# EAGLE schematic Atmega328p-Rst-Rec (EAGLE 8.0.1)
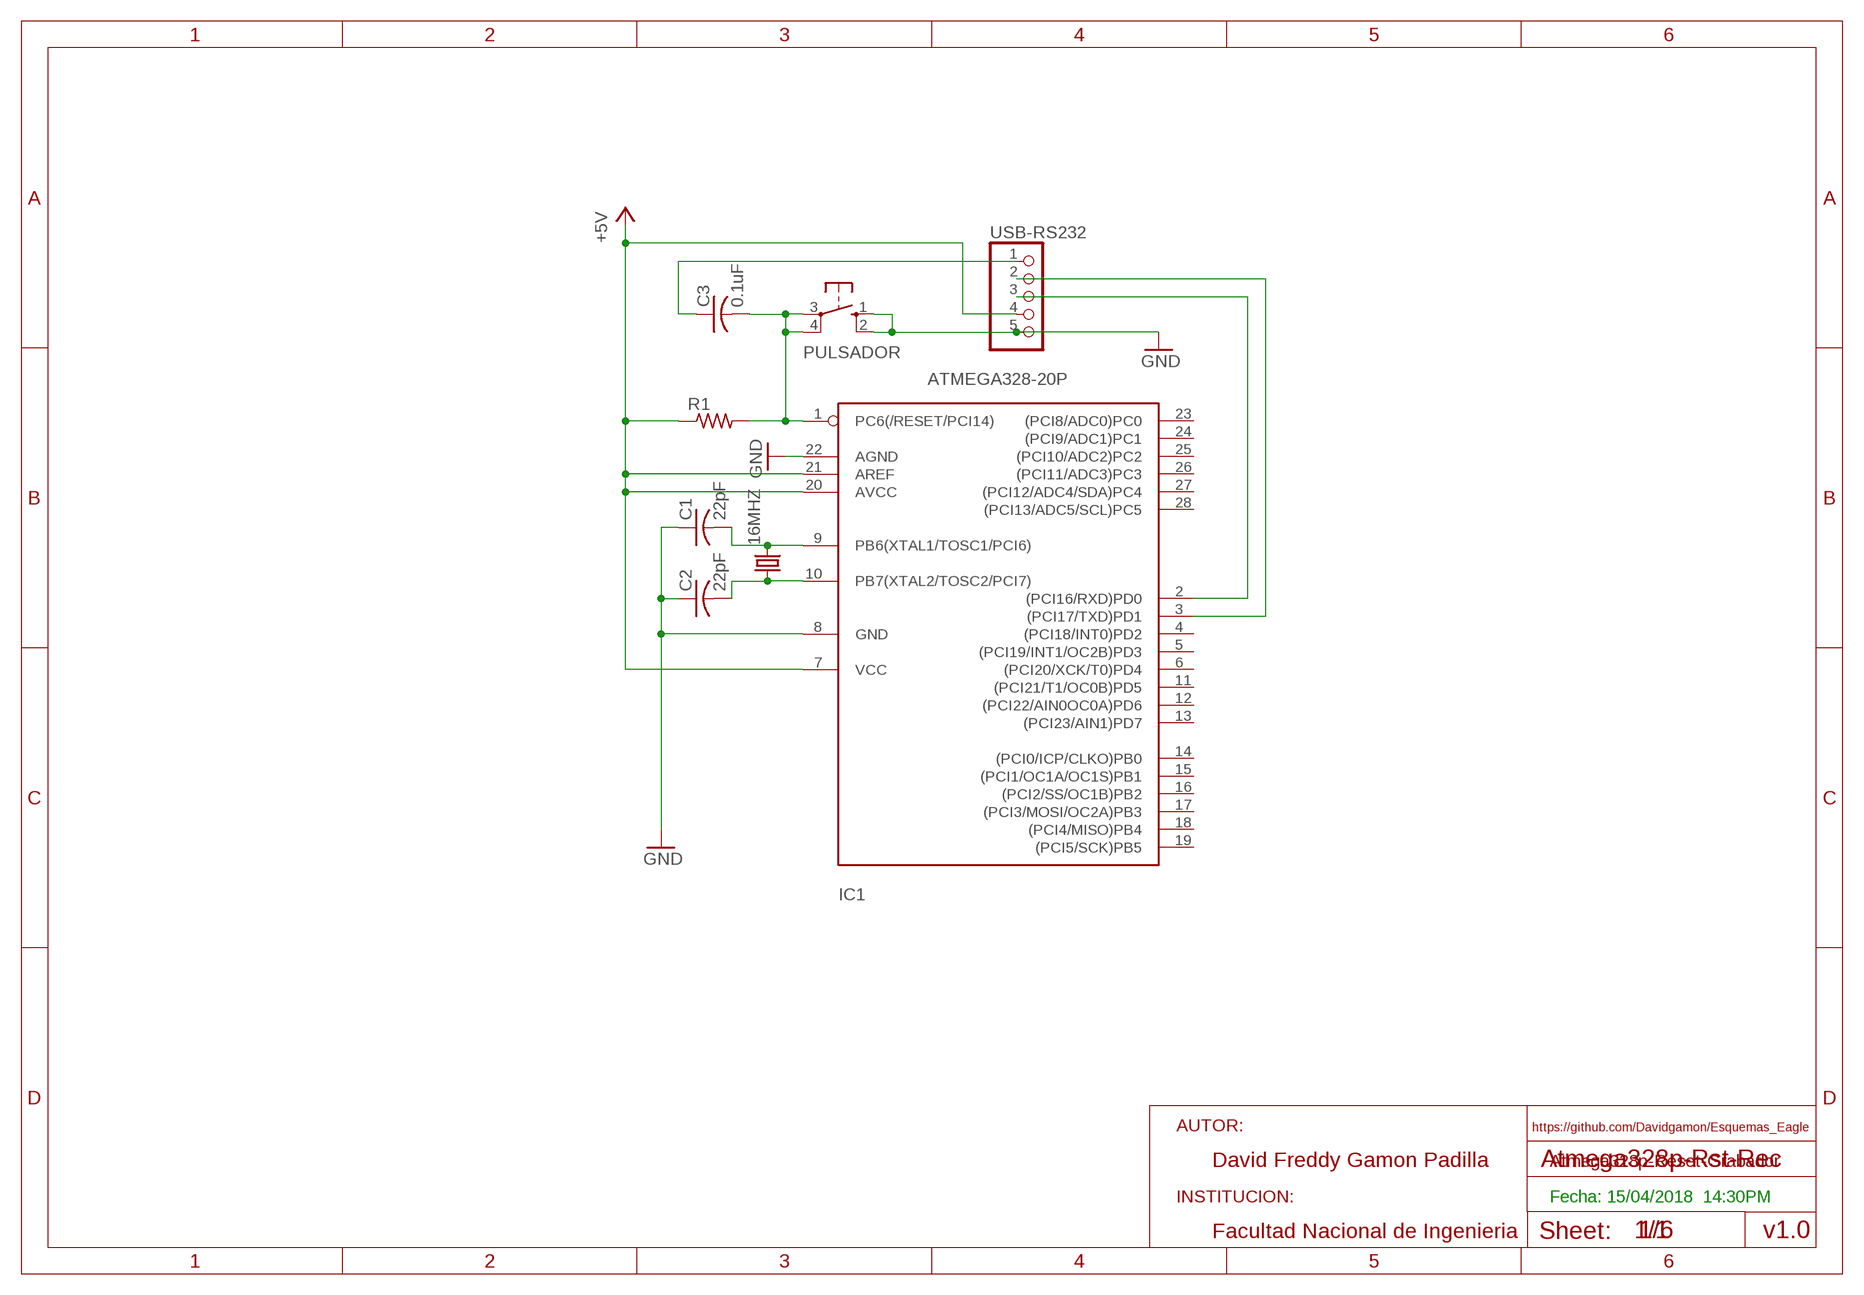
[diagram p0: schematic, sheet 1]

## Parts
16MHZ  CRYSTALHC49S  [HC49/S]
C1  22pF  C-US025-030X050  [C025-030X050]
C2  22pF  C-US025-030X050  [C025-030X050]
C3  0.1uF  C-US025-030X050  [C025-030X050]
IC1  ATMEGA328-20P  [DIL28-3]
PULSADOR  10-XX  [B3F-10XX]
R1  R-US_0309/12  [0309/12]
USB-RS232  PINHD-1X5  [1X05]

## Nets
+5V: IC1.7(VCC) IC1.20(AVCC) IC1.21(AREF) R1.1 USB-RS232.4
GND: C1.1 C2.1 IC1.8(GND) IC1.22(AGND) PULSADOR.1(S) PULSADOR.2(S1) USB-RS232.5
N$2: C3.1 USB-RS232.1
N$3: 16MHZ.2 C1.2 IC1.9(PB6(XTAL1/TOSC1/PCI6))
N$4: 16MHZ.1 C2.2 IC1.10(PB7(XTAL2/TOSC2/PCI7))
N$5: IC1.3((PCI17/TXD)PD1) USB-RS232.2
RESET: C3.2 IC1.1(PC6(/RESET/PCI14)) PULSADOR.3(P) PULSADOR.4(P1) R1.2
USB-RS232: IC1.2((PCI16/RXD)PD0) USB-RS232.3
Unconnected: IC1.4((PCI18/INT0)PD2) IC1.5((PCI19/INT1/OC2B)PD3) IC1.6((PCI20/XCK/T0)PD4) IC1.11((PCI21/T1/OC0B)PD5) IC1.12((PCI22/AIN0OC0A)PD6) IC1.13((PCI23/AIN1)PD7) IC1.14((PCI0/ICP/CLKO)PB0) IC1.15((PCI1/OC1A/OC1S)PB1) IC1.16((PCI2/SS/OC1B)PB2) IC1.17((PCI3/MOSI/OC2A)PB3) IC1.18((PCI4/MISO)PB4) IC1.19((PCI5/SCK)PB5) IC1.23((PCI8/ADC0)PC0) IC1.24((PCI9/ADC1)PC1) IC1.25((PCI10/ADC2)PC2) IC1.26((PCI11/ADC3)PC3) IC1.27((PCI12/ADC4/SDA)PC4) IC1.28((PCI13/ADC5/SCL)PC5)

## Notes on the sheet
- AUTOR: | https://github.com/Davidgamon/Esquemas_Eagle
- David Freddy Gamon Padilla | Atmega328p-Reset-Grabador
- INSTITUCION: | Fecha: 15/04/2018  14:30PM
- Facultad Nacional de Ingenieria | 1/6 | v1.0

## Library data of the parts
16MHZ = crystal:CRYSTAL: CRYSTAL; OC_FARNELL: 1667008; OC_NEWARK: unknown
C1-C3 = rcl:C-US: CAPACITOR, American symbol
IC1 = atmega328:ATMEGA328*P: MICROCONTROLLER 32 kBytes FLASH 2 kBytes SRAM 1 kBytes EEPROM USART 8-channel 10 bit ADC
PULSADOR = switch-omron:10-XX: OMRON SWITCH; MPN: B3F-1000; OC_FARNELL: 176432; OC_NEWARK: 36M3542
R1 = resistor:R-US_: RESISTOR, American symbol
USB-RS232 = pinhead:PINHD-1X5: PIN HEADER